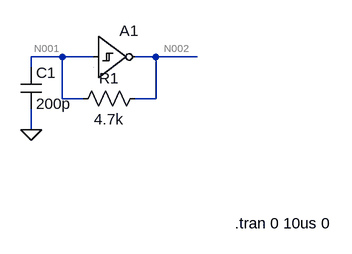
[diagram p0: schematic simple_osc.asc]
simple_osc.asc, the LTspice schematic file:
Version 4
SHEET 1 904 756
WIRE 64 224 16 224
WIRE 112 224 64 224
WIRE 208 224 176 224
WIRE 272 224 208 224
WIRE 16 240 16 224
WIRE 64 288 64 224
WIRE 96 288 64 288
WIRE 208 288 208 224
WIRE 208 288 176 288
WIRE 16 336 16 304
FLAG 16 336 0
SYMBOL Digital\\schmtinv 112 160 R0
WINDOW 3 -71 111 Invisible 0
SYMATTR InstName A1
SYMATTR Value Vhigh=3, Vt=1.35, Vh=0.3, trise=20n, tfall=20n
SYMBOL res 192 272 R90
WINDOW 0 0 56 VBottom 0
WINDOW 3 32 56 VTop 0
SYMATTR InstName R1
SYMATTR Value 4.7k
SYMBOL cap 0 240 R0
SYMATTR InstName C1
SYMATTR Value 200p
TEXT 330 480 Left 0 !.tran 0 10us 0

The netlist it stands for:
* simple_osc.asc
A1 N001 0 0 0 0 N002 0 0 SCHMITT Vhigh=3, Vt=1.35, Vh=0.3, trise=20n, tfall=20n
R1 N002 N001 4.7k
C1 N001 0 200p
.tran 0 10us 0
.backanno
.end

* Results of the author's LTspice run, read from the files saved beside the schematic
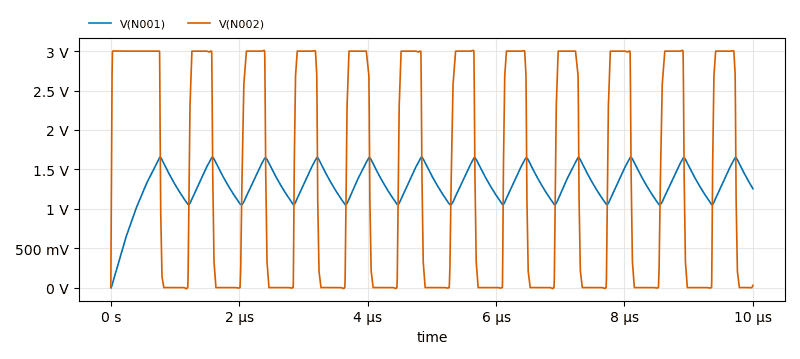
[diagram p1: Transient Analysis of simple_osc.asc, plotted from the saved traces]
* Transient Analysis, 1 run:
*   V(N001): min 0 V, max 1.654 V, average 1.314 V, rms 1.34 V, last 1.255 V
*   V(N002): min -15.2 mV, max 3.01 V, average 1.432 V, rms 2.031 V, last 27.99 mV